# EAGLE design AST1001 (EAGLE 6.3)
DATABASE: ./../../../../../Components/TinyCircuits_Part_Database.txt
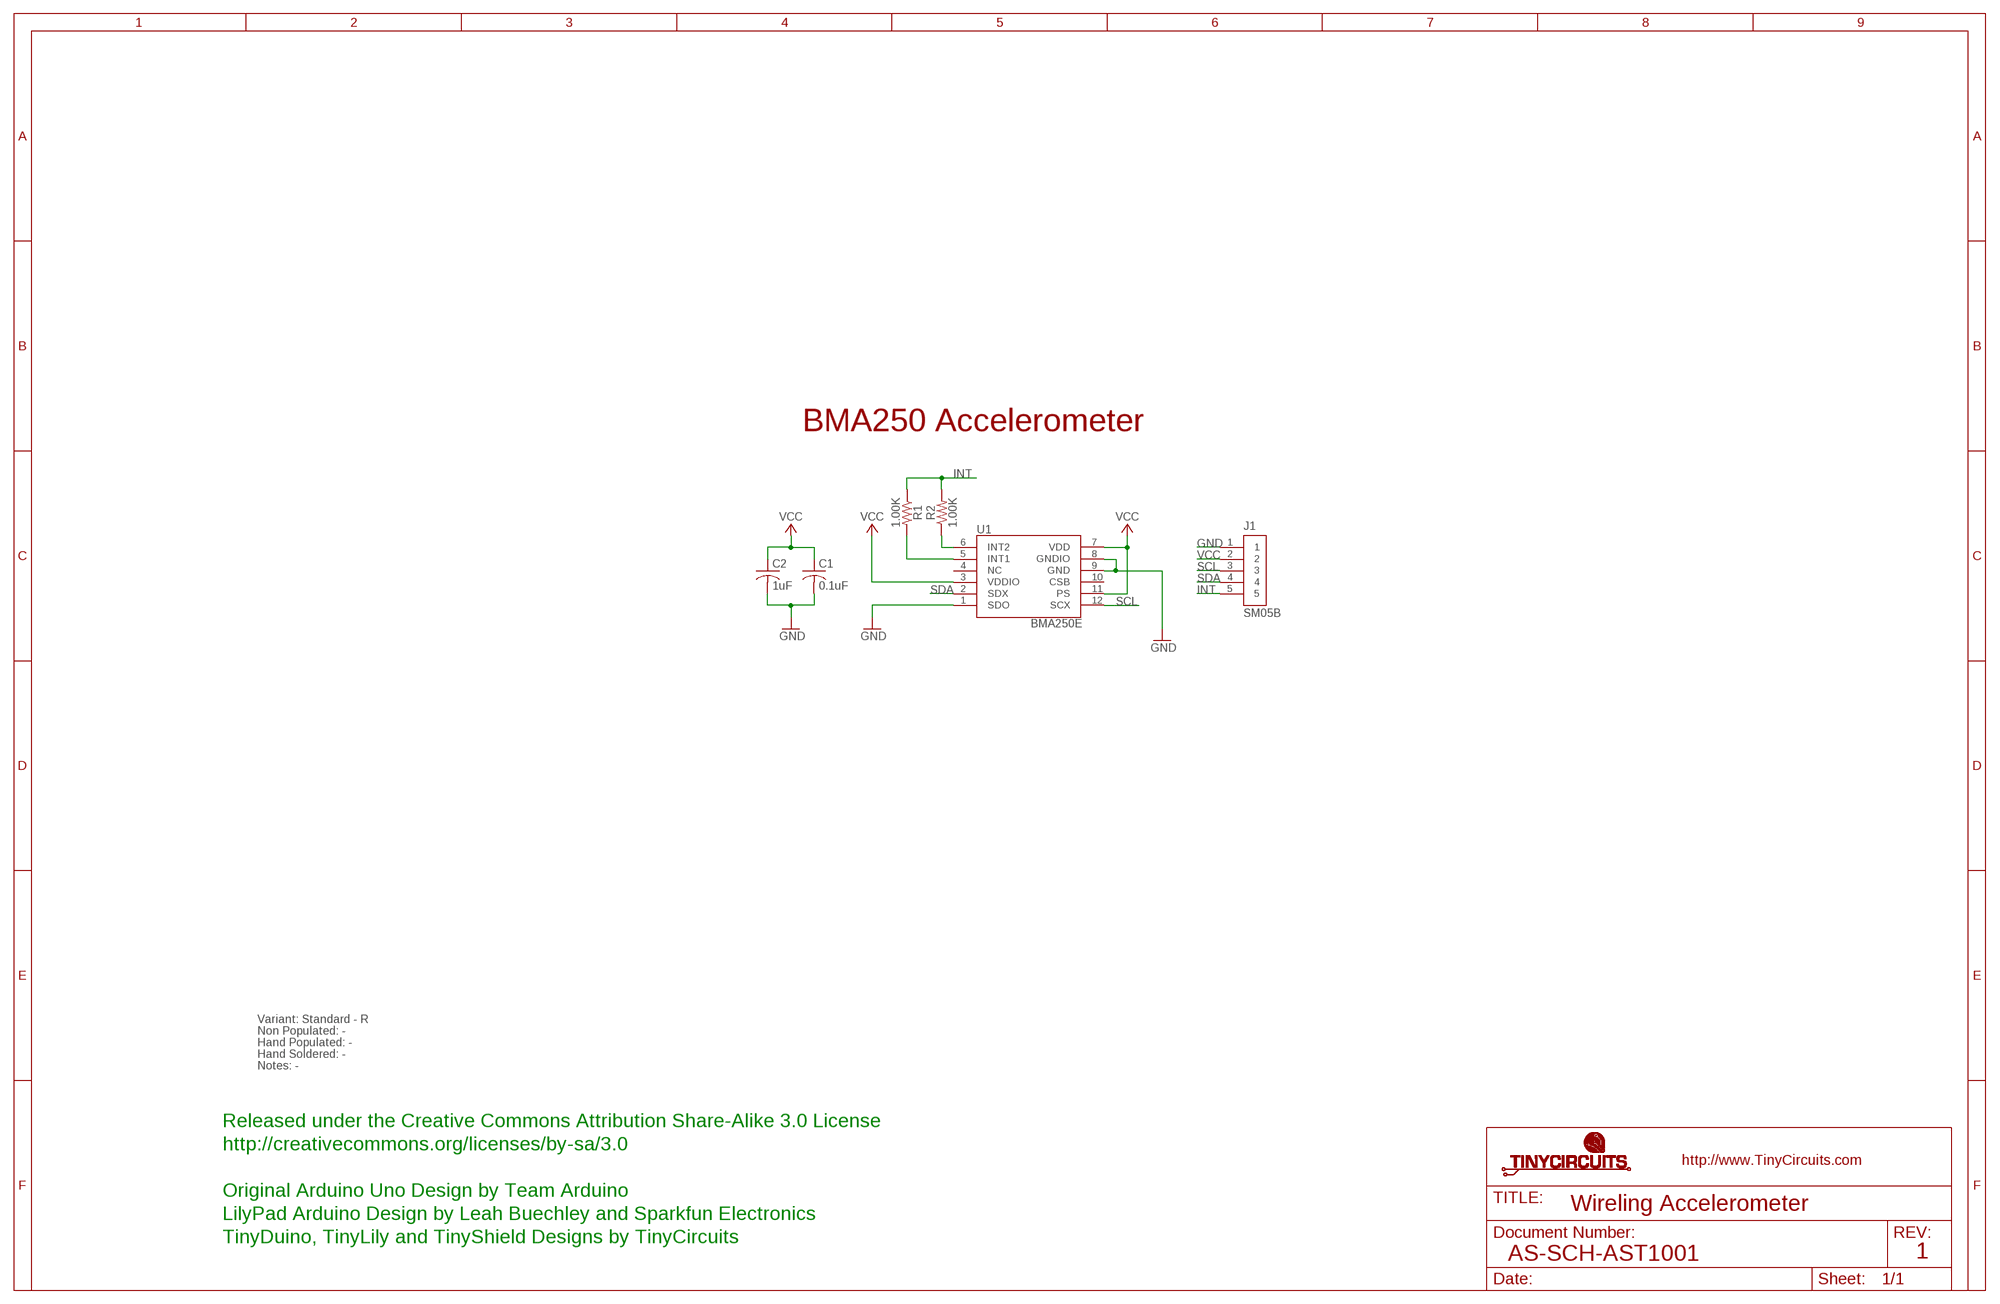
[diagram p0: schematic, sheet 1]

## Parts
C1  0.1uF  AS-ITM-00008  [C0402]
C2  1uF  AS-ITM-00410  [C0603]
J1  SM05B  AS-ITM-00340EDGE  [JST_SH_5X1_EDGE]
R1  1.00K  AS-ITM-00003  [0402]
R2  1.00K  AS-ITM-00003  [0402]
U1  BMA250E  AS-ITM-00070  [3-AXIS_ACCELEROMETER]

## Nets
GND: C1.2 C2.2 J1.1 U1.1(SDO) U1.8(GNDIO) U1.9(GND)
INT: J1.5 R1.1 R2.2
N$1: R1.2 U1.5(INT1)
N$2: R2.1 U1.6(INT2)
SCL: J1.3 U1.12(SCX)
SDA: J1.4 U1.2(SDX)
VCC: C1.1 C2.1 J1.2 U1.3(VDDIO) U1.7(VDD) U1.11(PS)
Unconnected: U1.4(NC) U1.10(CSB)

## Notes on the sheet
- BMA250 Accelerometer
- Variant: Standard - R
- Non Populated: -
- Hand Populated: -
- Hand Soldered: -
- Notes: -
- Released under the Creative Commons Attribution Share-Alike 3.0 License
- http://creativecommons.org/licenses/by-sa/3.0
- Original Arduino Uno Design by Team Arduino
- Wireling Accelerometer
- LilyPad Arduino Design by Leah Buechley and Sparkfun Electronics
- TinyDuino, TinyLily and TinyShield Designs by TinyCircuits
- AS-SCH-AST1001 | 1

## Library data of the parts
C1 = tinycircuits:AS-ITM-00008: CAP CER 0.1UF 16V 10% X5R 0402; PARTNO: AS-ITM-00008
C2 = tinycircuits:AS-ITM-00410: CAP CER 1UF 10V X5R 0603; PARTNO: AS-ITM-00410
J1 = tinycircuits:AS-ITM-00340: CONN HEADER SH 5POS SIDE 1MM TIN; PARTNO: AS-ITM-00340; PNPROTATION: 180
R1 R2 = tinycircuits:AS-ITM-00003: RES 1.00K OHM 1/16W 1% 0402; PARTNO: AS-ITM-00003
U1 = tinycircuits:AS-ITM-00070: 3-AXIS ACCELEROMOETER; PARTNO: AS-ITM-00070; PNPROTATION: 90; VALUE: BMA250

## Net classes
2 gnd: width 0.305 mm, drill 0.559 mm, clearance 0.254 mm

## Board
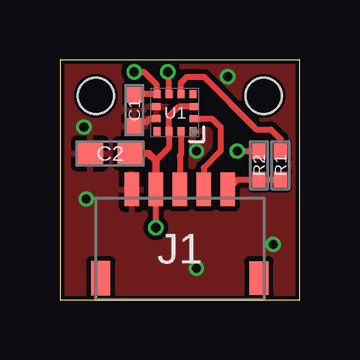
[diagram p1: board, top side]
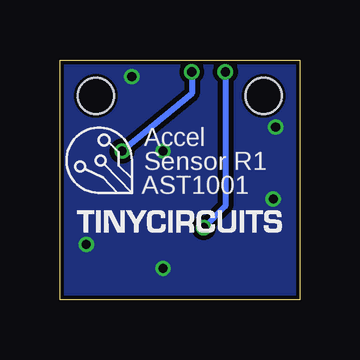
[diagram p2: board, bottom side, seen from below]

Size 10 x 10 mm. Coordinates in mm from the lower left corner, seen from the top.
Outline: 0,0 10,0 10,10 0,10 0,0
Copper layers (1*16): Top 0.035mm / dielectric 1.5mm / Bottom 0.035mm
Design rules "default *": minimum track width 8mil, minimum drill 15mil, track to track 8mil, track to pad 8mil, pad to pad 8mil, via to via 8mil, smd to smd 8mil, copper to edge 6mil, drill to drill 8mil, minimum pad ring 8mil, minimum via ring 5mil, stop-mask expansion 4mil, vias tented up to drill 25mil, thermal gap 10mil
Holes 1.5 mm at 1.5,8.5 8.5,8.5

### Footprints (pad centres in the part's own frame; a part is rotated, then mirrored left to right if it is on the bottom)
C0402 = smd 0.65 x 0.6: 1 -0.65,0; 2 0.65,0
C0603 = smd 1.1 x 1: 1 -0.85,0; 2 0.85,0
JST_SH_5X1_EDGE = smd 0.6 x 1.4: 1 -2,2.475; 2 -1,2.475; 3 0,2.475; 4 1,2.475; 5 2,2.475 | smd 0.8 x 1.4: PAD1 -3.3,-1.225; PAD2 3.3,-1.225
0402 = smd 0.65 x 0.55: 1 -0.6,0; 2 0.6,0
3-AXIS_ACCELEROMETER = smd 0.3 x 0.35: 1 -0.75,0.775; 4 -0.75,-0.775; 5 -0.25,-0.775; 6 0.25,-0.775; 7 0.75,-0.775; 10 0.75,0.775; 11 0.25,0.775; 12 -0.25,0.775 | smd 0.35 x 0.3: 2 -0.775,0.25; 3 -0.775,-0.25; 8 0.775,-0.25; 9 0.775,0.25

### Placement (x,y rotation side)
C1  3.1,7.9 270 top
C2  2.1,6.1 180 top
J1  5,2.12 0 top
R1  9.2,5.6 90 top
R2  8.3,5.6 270 top
U1  4.8,7.8 180 top
U$1  [DOCFIELD-TINYCIRCUITS-PCB]  19,-10 0 top  (outside the outline)

### Tracks (layer width: path | path; a pad name or v marks a point on that pad's centre or on a via)
GND  (via drill 0.38)
  Top 0.254: U1.9 3.75,7.55 3.6,7.4 3.25,7.4 C1.2
  other vias: 8.9,2.3 1,7.2 5.7,6.2 1.1,4.2 5.7,1.3 7,9.3
  pour Bottom: 0,10 10,10 10,0 0,0
  pour Top: 0,10 10,10 10,0 0,0
INT
  Top 0.254: R1.1 R2.2 7.4,5 J1.5
N$1
  Top 0.254: U1.5 5.05,9.05 5.3,9.3 6,9.3 8.2,7.1 8.8,7.1 9.2,6.7 R1.2
N$2  (via drill 0.38)
  Top 0.254: U1.6 4.55,9.45 v4.5,9.5 | v7.4,6.2 R2.1
  Bottom 0.254: v4.5,9.5 4.5,8.6 v7.4,6.2
SCL
  Top 0.254: 5.05,4.65 J1.3 5,6 5.05,6.05 U1.12
SDA
  Top 0.254: U1.2 6.35,7.55 6.7,7.2 6.7,6.2 6,5.5 J1.4
VCC  (via drill 0.38)
  Top 0.254: 4,5.8 4.55,6.35 U1.11 4.55,7.65 4.95,8.05 U1.3 | C1.1 3.12,8.57 U1.7 4.05,8.95 3.5,9.5 v3.1,9.5 | v4,3 J1.2
  Top 0.305: C2.1 3.7,6.1 4,5.8 J1.2
  Bottom 0.254: v3.1,9.5 3.1,3.9 v4,3

### Text on the board
bPlace: Accel | Sensor R1 | AST1001
Document: FABRICATION DRAWING | NOTES: | 1. PRINTED CIRCUIT BOARD MADE FROM NEMA GRADE FR-4 EPOXY LAMINATE | WITH 1 OUNCE COPPER PLATING AND .024 THICKNESS. | 2. ALL DIMENSIONS ARE GIVEN IN MILLIMETERS. | 3. CIRCUIT PATHS ARE FOR REFERENCE ONLY. | 4. HOLE SIZES SHOWN ARE FINISHED DIAMETERS AFTER PLATING. | 5. BOARD PLATED USING REFLOW OR SIMILAR METHOD. | 6. BOARD TO HAVE BLUE SOLDER MASK ON PLATED SURFACES USING WET FILM | 7. SILKSCREEN BOARD USING WHITE INK. | SR100 OR SR1010 EPOXY. EQUIVALENT WET OR DRY FILM MAY BE USED. | 8. THE FOLLOWING INFORMATION APPLIES TO THIS BOARD: | * 2 COPPER LAYERS | * .024 BOARD THICKNESS | * REQUIRES TOP SIDE SILKSCREEN | Released under the Creative Commons Attribution Share-Alike 3.0 License | http://creativecommons.org/licenses/by-sa/3.0 | Original Arduino Uno Design by Team Arduino | LilyPad Arduino Design by Leah Buechley and Sparkfun Electronics | TinyDuino, TinyLily and TinyShield Designs by TinyCircuits | Wireling Accelerometer | AS-PCB-AST1001 | 1